# Altium schematic sheet CamLink.SchDoc
size B; SheetNumber: 1; SheetTotal: 5
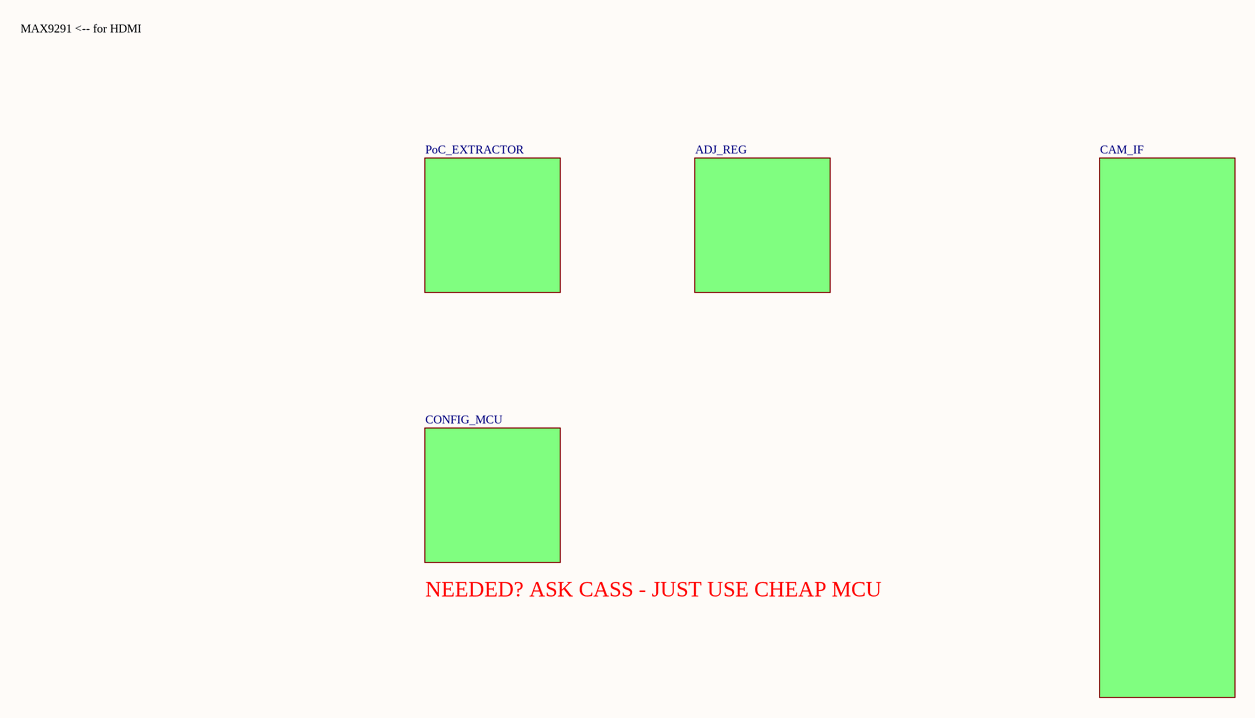
[diagram p0: CamLink.SchDoc]

## Sub-sheets
ADJ_REG = ADJ_REG: no entries
CAM_IF = CAM_IF: no entries
CONFIG_MCU = CONFIG_MCU: no entries
PoC_EXTRACTOR = PoC_EXTRACTOR: no entries

## Notes on the sheet
- MAX9291 <-- for HDMI
- NEEDED? ASK CASS - JUST USE CHEAP MCU